# Altium schematic sheet Accel.SchDoc
size A; SheetNumber: 2; SheetTotal: 2
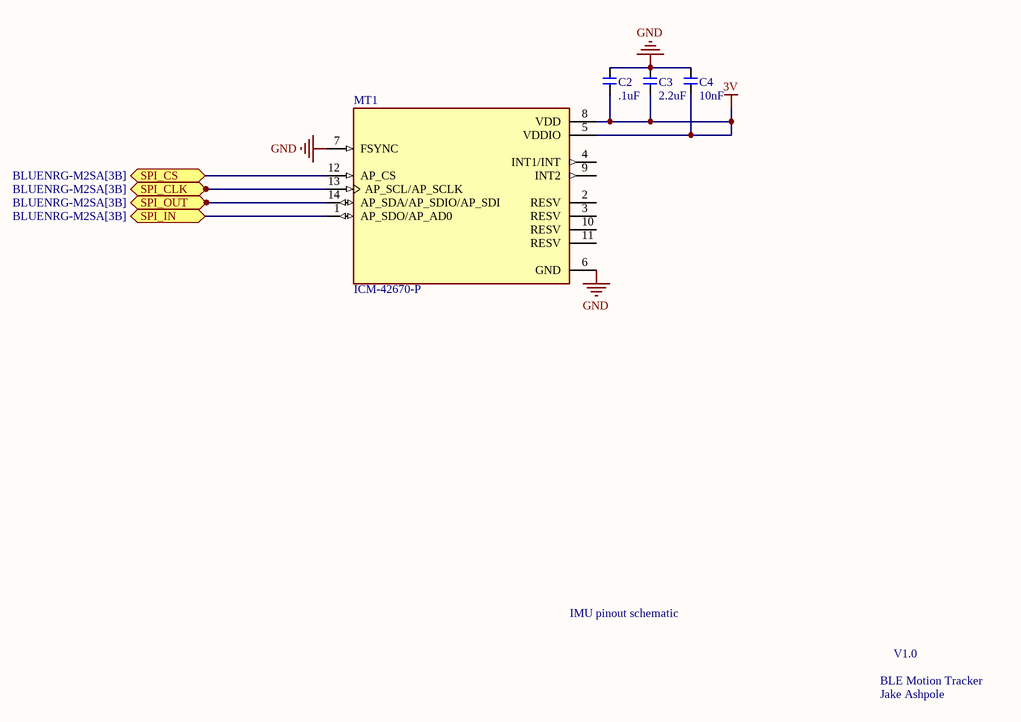
[diagram p0: Accel.SchDoc]

## Parts
C2  .1uF  [CAP-0603]
C3  2.2uF  [CAP-0603]
C4  10nF  [CAP-0603]
MT1  ICM-42670-P  [XDCR_ICM-42670-P]

## Ports
SPI_CLK (bidir, see BLUENRG-M2SA[3B]), SPI_CS (bidir, see BLUENRG-M2SA[3B]), SPI_IN (bidir, see BLUENRG-M2SA[3B]), SPI_OUT (bidir, see BLUENRG-M2SA[3B])

## Nets
3V: C2.1 C3.1 C4.1 MT1.5(VDDIO) MT1.8(VDD)
GND: C2.2 C3.2 C4.2 MT1.6(GND) MT1.7(FSYNC)
SPI_CLK: MT1.13(AP_SCL/AP_SCLK) ; port SPI_CLK
SPI_CS: MT1.12(AP_CS) ; port SPI_CS
SPI_IN: MT1.1(AP_SDO/AP_AD0) ; port SPI_IN
SPI_OUT: MT1.14(AP_SDA/AP_SDIO/AP_SDI) ; port SPI_OUT

Not connected (* = marked no-connect by the designer): MT1 2(RESV) 3(RESV) 4(INT1/INT) 9(INT2) 10(RESV) 11(RESV)

## Notes on the sheet
- IMU pinout schematic
- BLE Motion Tracker
- V1.0
- Jake Ashpole

## Library data of the parts
C2-C4 = CMP-009-000303-1: Source: ife19_Elec_Library.SchLib; Design Item ID: CAP-0603
MT1 = ICM-42670-P: https://www.mouser.com/ProductDetail/TDK-InvenSense/ICM-42670-P?qs=iLbezkQI%2BsgK8sMF5V7fQQ%3D%3D; Package: None; Price: None; Value: *; MP: ICM-42670-P; Availability: Unavailable